# Altium schematic sheet Peripheral_Circuit_B.SchDoc
size A4
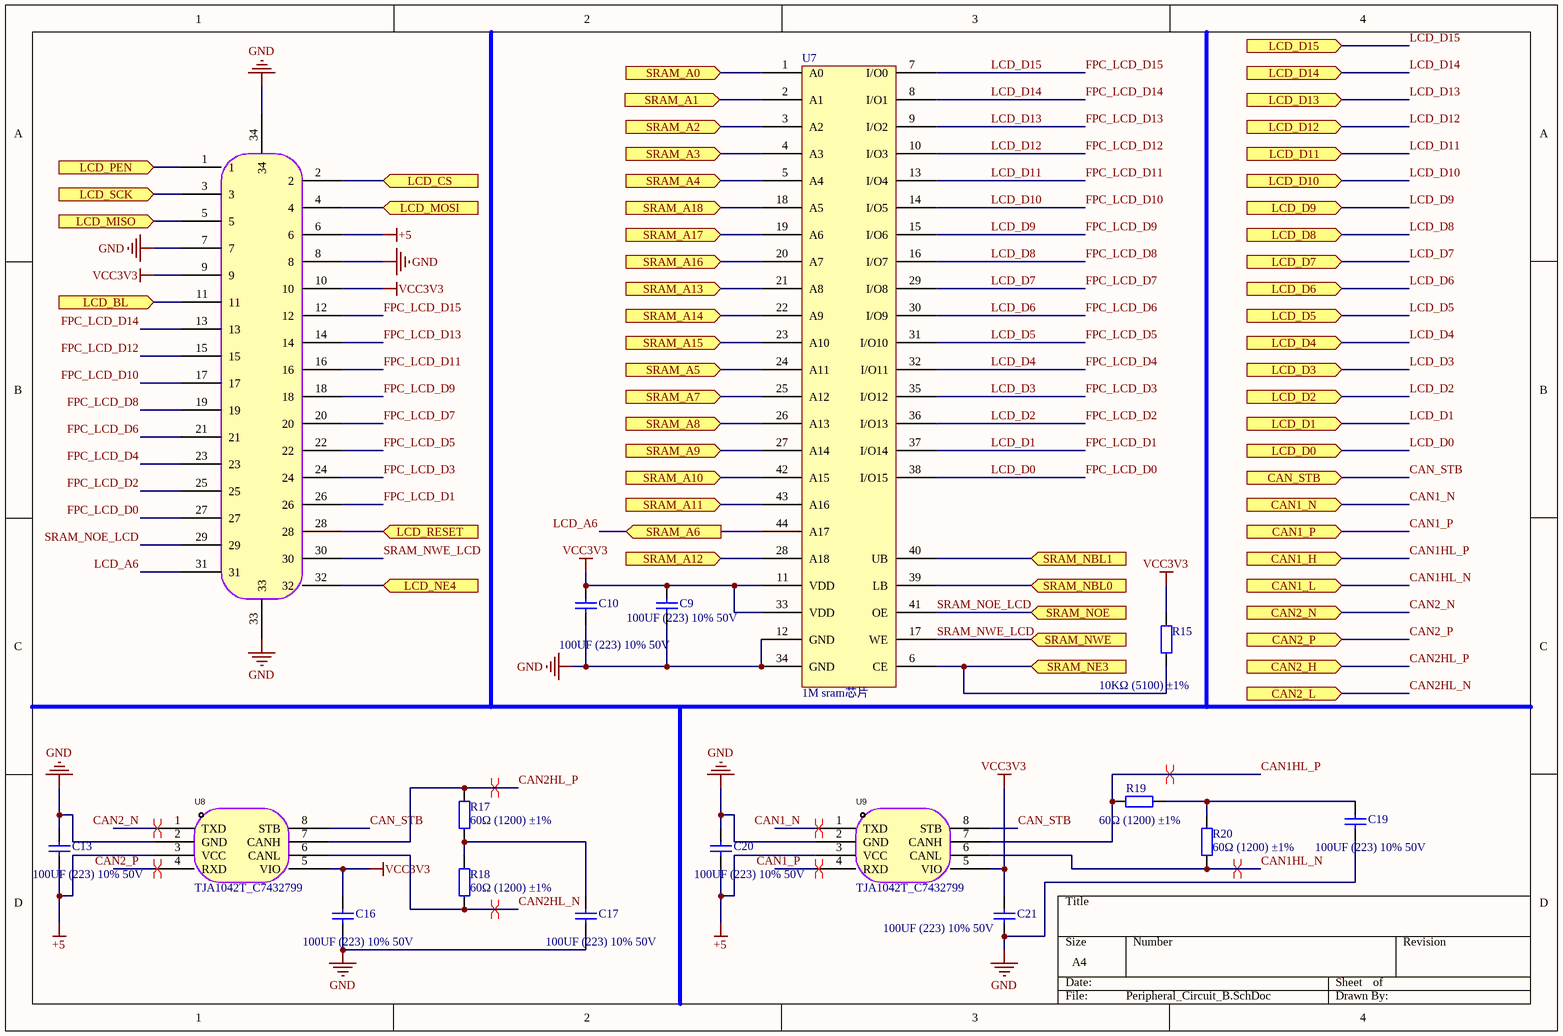
[diagram p0: Peripheral_Circuit_B.SchDoc]

## Parts
C9  100UF (223) 10% 50V  [0805_C]
C10  100UF (223) 10% 50V  [0805_C]
C13  100UF (223) 10% 50V  [0805_C]
C16  100UF (223) 10% 50V  [0805_C]
C17  100UF (223) 10% 50V  [0805_C]
C19  100UF (223) 10% 50V  [0805_C]
C20  100UF (223) 10% 50V  [0805_C]
C21  100UF (223) 10% 50V  [0805_C]
FPC1  FPC-05F-32PH20  [FPC-SMD_32P-P0.50_XUNPU_FPC-05F-32PH20]  (value not drawn)
R15  10KΩ (5100) ±1%  [0805_R]
R17  60Ω (1200) ±1%  [0805_R]
R18  60Ω (1200) ±1%  [0805_R]
R19  60Ω (1200) ±1%  [0805_R]
R20  60Ω (1200) ±1%  [0805_R]
U7  1M sram芯片  [IS61LV51216]
U8  TJA1042T_C7432799  [TJA1042]
U9  TJA1042T_C7432799  [TJA1042]

## Ports
CAN1_H (in), CAN1_L (in), CAN1_N (in), CAN1_P (in), CAN2_H (in), CAN2_L (in), CAN2_N (in), CAN2_P (in), CAN_STB (in), LCD_BL (in), LCD_CS (in), LCD_D0 (in), LCD_D1 (in), LCD_D2 (in), LCD_D3 (in), LCD_D4 (in), LCD_D5 (in), LCD_D6 (in), LCD_D7 (in), LCD_D8 (in), LCD_D9 (in), LCD_D10 (in), LCD_D11 (in), LCD_D12 (in), LCD_D13 (in), LCD_D14 (in), LCD_D15 (in), LCD_MISO (in), LCD_MOSI (in), LCD_NE4 (in), LCD_PEN (in), LCD_RESET (in), LCD_SCK (in), SRAM_A0 (in), SRAM_A1 (in), SRAM_A2 (in), SRAM_A3 (in), SRAM_A4 (in), SRAM_A5 (in), SRAM_A6 (in), SRAM_A7 (in), SRAM_A8 (in), SRAM_A9 (in), SRAM_A10 (in), SRAM_A11 (in), SRAM_A12 (in), SRAM_A13 (in), SRAM_A14 (in), SRAM_A15 (in), SRAM_A16 (in), SRAM_A17 (in), SRAM_A18 (in), SRAM_NBL0 (in), SRAM_NBL1 (in), SRAM_NE3 (in), SRAM_NOE (in), SRAM_NWE (in)

## Nets
+5: C13.1 C20.1 FPC1.6 U8.3(VCC) U9.3(VCC)
GND: C9.1 C10.1 C13.2 C16.1 C17.1 C19.1 C20.2 C21.1 FPC1.7 FPC1.8 FPC1.33 FPC1.34 U7.12(GND) U7.34(GND) U8.2(GND) U9.2(GND)
VCC3V3: C9.2 C10.2 C16.2 C21.2 FPC1.9 FPC1.10 R15.2 U7.11(VDD) U7.33(VDD) U8.5(VIO) U9.5(VIO)
CAN1_N: U9.1(TXD) ; port CAN1_N
CAN1_P: U9.4(RXD) ; port CAN1_P
CAN1HL_N: R20.1 U9.6(CANL) ; port CAN1_L
CAN1HL_P: R19.2 U9.7(CANH) ; port CAN1_H
CAN2_N: U8.1(TXD) ; port CAN2_N
CAN2_P: U8.4(RXD) ; port CAN2_P
CAN2HL_N: R18.1 U8.6(CANL) ; port CAN2_L
CAN2HL_P: R17.2 U8.7(CANH) ; port CAN2_H
CAN_STB: U8.8(STB) U9.8(STB) ; port CAN_STB
FPC_LCD_D0: FPC1.27 U7.38(I/O15) ; port LCD_D0  [also labelled LCD_D0]
FPC_LCD_D1: FPC1.26 U7.37(I/O14) ; port LCD_D1  [also labelled LCD_D1]
FPC_LCD_D2: FPC1.25 U7.36(I/O13) ; port LCD_D2  [also labelled LCD_D2]
FPC_LCD_D3: FPC1.24 U7.35(I/O12) ; port LCD_D3  [also labelled LCD_D3]
FPC_LCD_D4: FPC1.23 U7.32(I/O11) ; port LCD_D4  [also labelled LCD_D4]
FPC_LCD_D5: FPC1.22 U7.31(I/O10) ; port LCD_D5  [also labelled LCD_D5]
FPC_LCD_D6: FPC1.21 U7.30(I/O9) ; port LCD_D6  [also labelled LCD_D6]
FPC_LCD_D7: FPC1.20 U7.29(I/O8) ; port LCD_D7  [also labelled LCD_D7]
FPC_LCD_D8: FPC1.19 U7.16(I/O7) ; port LCD_D8  [also labelled LCD_D8]
FPC_LCD_D9: FPC1.18 U7.15(I/O6) ; port LCD_D9  [also labelled LCD_D9]
FPC_LCD_D10: FPC1.17 U7.14(I/O5) ; port LCD_D10  [also labelled LCD_D10]
FPC_LCD_D11: FPC1.16 U7.13(I/O4) ; port LCD_D11  [also labelled LCD_D11]
FPC_LCD_D12: FPC1.15 U7.10(I/O3) ; port LCD_D12  [also labelled LCD_D12]
FPC_LCD_D13: FPC1.14 U7.9(I/O2) ; port LCD_D13  [also labelled LCD_D13]
FPC_LCD_D14: FPC1.13 U7.8(I/O1) ; port LCD_D14  [also labelled LCD_D14]
FPC_LCD_D15: FPC1.12 U7.7(I/O0) ; port LCD_D15  [also labelled LCD_D15]
LCD_A6: FPC1.31 U7.44(A17) ; port SRAM_A6
LCD_BL: FPC1.11 ; port LCD_BL
LCD_CS: FPC1.2 ; port LCD_CS
LCD_MISO: FPC1.5 ; port LCD_MISO
LCD_MOSI: FPC1.4 ; port LCD_MOSI
LCD_NE4: FPC1.32 ; port LCD_NE4
LCD_PEN: FPC1.1 ; port LCD_PEN
LCD_RESET: FPC1.28 ; port LCD_RESET
LCD_SCK: FPC1.3 ; port LCD_SCK
SRAM_A0: U7.1(A0) ; port SRAM_A0
SRAM_A1: U7.2(A1) ; port SRAM_A1
SRAM_A2: U7.3(A2) ; port SRAM_A2
SRAM_A3: U7.4(A3) ; port SRAM_A3
SRAM_A4: U7.5(A4) ; port SRAM_A4
SRAM_A5: U7.24(A11) ; port SRAM_A5
SRAM_A7: U7.25(A12) ; port SRAM_A7
SRAM_A8: U7.26(A13) ; port SRAM_A8
SRAM_A9: U7.27(A14) ; port SRAM_A9
SRAM_A10: U7.42(A15) ; port SRAM_A10
SRAM_A11: U7.43(A16) ; port SRAM_A11
SRAM_A12: U7.28(A18) ; port SRAM_A12
SRAM_A13: U7.21(A8) ; port SRAM_A13
SRAM_A14: U7.22(A9) ; port SRAM_A14
SRAM_A15: U7.23(A10) ; port SRAM_A15
SRAM_A16: U7.20(A7) ; port SRAM_A16
SRAM_A17: U7.19(A6) ; port SRAM_A17
SRAM_A18: U7.18(A5) ; port SRAM_A18
SRAM_NBL0: U7.39(LB) ; port SRAM_NBL0
SRAM_NBL1: U7.40(UB) ; port SRAM_NBL1
SRAM_NE3: R15.1 U7.6(CE) ; port SRAM_NE3
SRAM_NOE_LCD: FPC1.29 U7.41(OE) ; port SRAM_NOE
SRAM_NWE_LCD: FPC1.30 U7.17(WE) ; port SRAM_NWE
NetC17_2: C17.2 R17.1 R18.2
NetC19_2: C19.2 R19.1 R20.2

## Layout directives
differential pair: CAN1_N, CAN1_P, CAN1HL_N, CAN1HL_P, CAN2_N, CAN2_P, CAN2HL_N, CAN2HL_P

## Library data of the parts
C9 C10 C13 C16 C17 C19-C21 = 0805 22nF (223) 10% 50V: 贴片电容; ComponentLink1Description: 供应商链接; ComponentLink1URL: http://www.szlcsc.com/product/details_2081.html; Package: 0805; Supplier: LC; SuppliersPartNumber: C1729
FPC1 = FPC-05F-32PH20: Manufacturer: XUNPU(讯普); Add into BOM: yes; Name: FPC-05F-32PH20; Symbol: FPC-05F-32PH20; Device: FPC-05F-32PH20; LCSC Part Name: 32P 0.5mm; Supplier Part: C2856809; Manufacturer Part: FPC-05F-32PH20; Supplier Footprint: SMD; JLCPCB Part Class: Extended Part; Supplier: LCSC; Convert to PCB: yes
R15 = 0805 510Ω (5100) 1%: 贴片电阻; ComponentLink1Description: 供应商链接; ComponentLink1URL: http://www.szlcsc.com/product/details_18422.html; Package: 0805; Supplier: LC; SuppliersPartNumber: C17734
R17-R20 = 0805 120Ω (1200) 1%: 贴片电阻; ComponentLink1Description: 供应商链接; ComponentLink1URL: http://www.szlcsc.com/product/details_18125.html; Package: 0805; Supplier: LC; SuppliersPartNumber: C17437
U7 = XM8A51216V33A: 外接SRAM芯片
U8 U9 = TJA1042T_C7432799: Manufacturer: Tokmas(托克马斯); Add into BOM: yes; Name: TJA1042T; Symbol: TJA1042T_C7432799; Device: TJA1042T_C7432799; LCSC Part Name: TJA1042T; Supplier Part: C7432799; Manufacturer Part: TJA1042T; Supplier Footprint: SOP-8; JLCPCB Part Class: Extended Part; Datasheet: https://atta.szlcsc.com/upload/public/pdf/source/20230625/BF864921860ECC2FF6AF6AEDC281998F.pdf; Supplier: LCSC; Convert to PCB: yes; link: https://atta.szlcsc.com/upload/public/pdf/source/20230621/7AB02851301655B02FC6140105FC6246.pdf